# EAGLE design core-feather-shield-adc-hGacc (EAGLE 9.5.0)
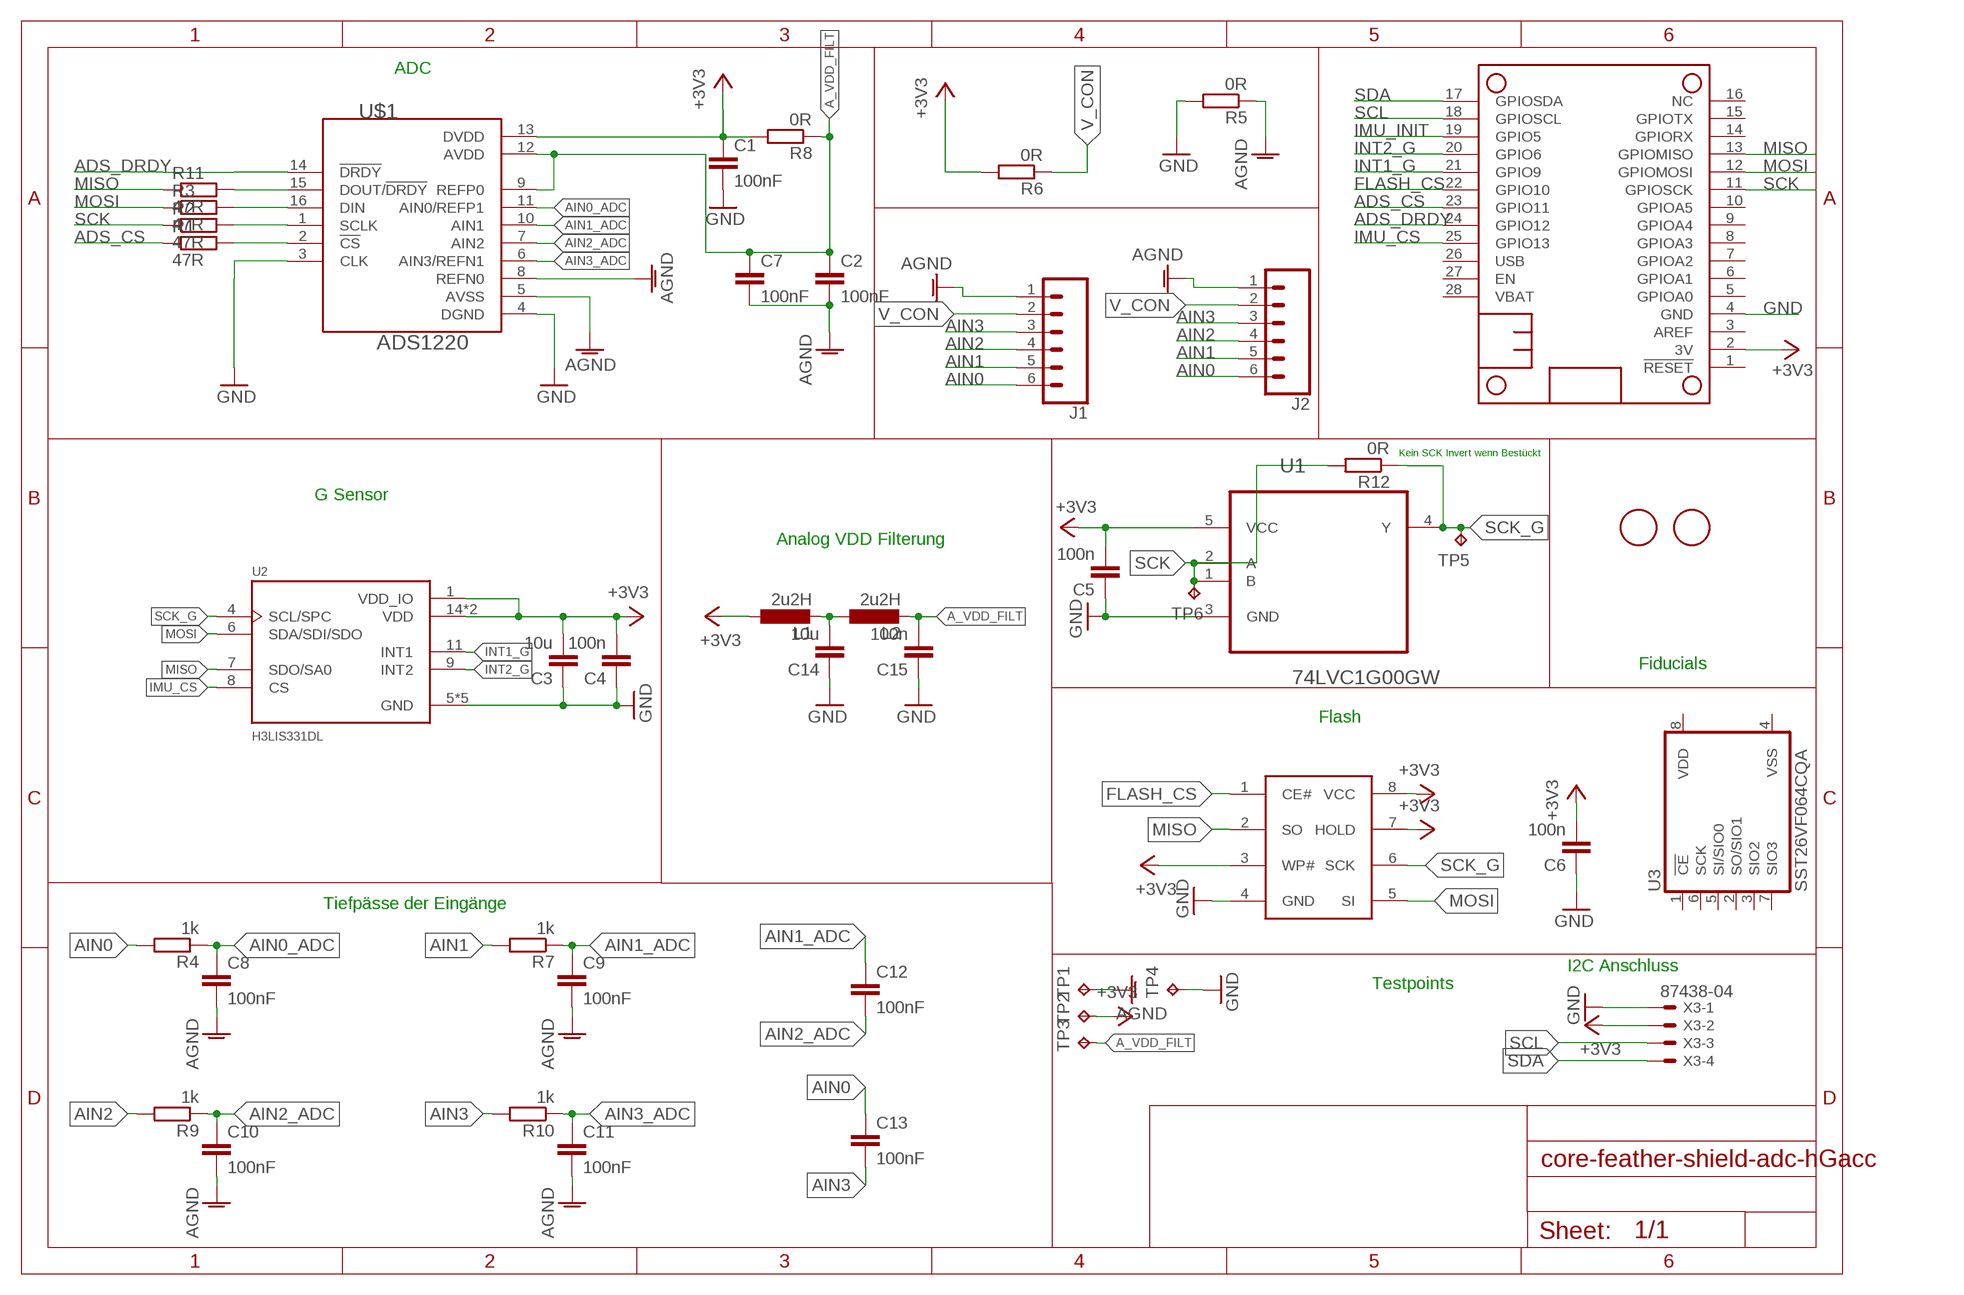
[diagram p0: schematic, sheet 1]

## Parts
C1  100nF  C-EUC0805  [C0805]
C2  100nF  C-EUC0805  [C0805]
C3  10u  C-EUC0805  [C0805]
C4  100n  C-EUC0805  [C0805]
C5  100n  C-EUC0805  [C0805]
C6  100n  C-EUC0805  [C0805]
C7  100nF  C-EUC0805  [C0805]
C8  100nF  C-EUC0805  [C0805]
C9  100nF  C-EUC0805  [C0805]
C10  100nF  C-EUC0805  [C0805]
C11  100nF  C-EUC0805  [C0805]
C12  100nF  C-EUC0805  [C0805]
C13  100nF  C-EUC0805  [C0805]
C14  10u  C-EUC0805  [C0805]
C15  100n  C-EUC0805  [C0805]
J1  CONN_06SMD_MALE  [1X06_SMD_MALE]
J2  CONN_06SMD_MALE  [1X06_SMD_MALE]
L1  2u2H  L-EUL0805  [L0805]
L2  2u2H  L-EUL0805  [L0805]
MS1  FEATHERWING  [FEATHERWING]
R1  47R  R-EU_R0805  [R0805]
R2  47R  R-EU_R0805  [R0805]
R3  47R  R-EU_R0805  [R0805]
R4  1k  R-EU_R0805  [R0805]
R5  0R  R-EU_R0805  [R0805]
R6  0R  R-EU_R0805  [R0805]
R7  1k  R-EU_R0805  [R0805]
R8  0R  R-EU_R0805  [R0805]
R9  1k  R-EU_R0805  [R0805]
R10  1k  R-EU_R0805  [R0805]
R11  47R  R-EU_R0805  [R0805]
R12  0R  R-EU_R0805  [R0805]
TP1  TPTP10R  [TP10R]
TP2  TPTP10R  [TP10R]
TP3  TPTP10R  [TP10R]
TP4  TPTP10R  [TP10R]
TP5  TPTP10R  [TP10R]
TP6  TPTP10R  [TP10R]
U1  74LVC1G00GW  [SOT65P210X110-5N]
U2  H3LIS331DL  [QFN300X300X100-16N]
U3  SST26VF064CQA  [WSON8]
U$1  ADS1220  [TSSOP-16]
U$2  IS25LP128F-JKLE-TR  [WSON-8-PAD]
U$8  FIDUCIAL  [FIDUCIAL_1MM]
U$9  FIDUCIAL  [FIDUCIAL_1MM]
X3  87438-04  [87438-04]

## Nets
+3V3: C1.1 C3.2 C4.2 C5.2 C6.2 L1.1 MS1.2(3V) R6.2 R8.2 TP2.TP U1.5(VCC) U2.1(VDD_IO) U2.14(VDD) U2.15(VDD) U$1.13(DVDD) U$2.3(WP#) U$2.7(HOLD) U$2.8(VCC) X3.2
A_VDD_FILT: C2.1 C7.1 C15.2 L2.2 R8.1 TP3.TP U$1.9(REFP0) U$1.12(AVDD)
ADS_CS: MS1.23(GPIO11) R1.1
ADS_DRDY: MS1.24(GPIO12) U$1.14(!DRDY)
AGND: C2.2 C7.2 C8.2 C9.2 C10.2 C11.2 J1.1 J2.1 R5.1 TP1.TP U$1.5(AVSS) U$1.8(REFN0)
AIN0: C13.1 J1.6 J2.6 R4.2
AIN0_ADC: C8.1 R4.1 U$1.11(AIN0/REFP1)
AIN1: J1.5 J2.5 R7.2
AIN1_ADC: C9.1 C12.1 R7.1 U$1.10(AIN1)
AIN2: J1.4 J2.4 R9.2
AIN2_ADC: C10.1 C12.2 R9.1 U$1.7(AIN2)
AIN3: C13.2 J1.3 J2.3 R10.2
AIN3_ADC: C11.1 R10.1 U$1.6(AIN3/REFN1)
FLASH_CS: MS1.22(GPIO10) U$2.1(CE#)
GND: C1.2 C3.1 C4.1 C5.1 C6.1 C14.1 C15.1 MS1.4(GND) R5.2 TP4.TP U1.3(GND) U2.5(GND) U2.10(GND) U2.12(GND) U2.13(GND) U2.16(GND) U$1.4(DGND) U$2.4(GND) X3.1
IMU_CS: MS1.25(GPIO13) U2.8(CS)
IMU_INIT: MS1.19(GPIO5)
INT1_G: MS1.21(GPIO9) U2.11(INT1)
INT2_G: MS1.20(GPIO6) U2.9(INT2)
MISO: MS1.13(GPIOMISO) R11.1 U2.7(SDO/SA0) U$2.2(SO)
MOSI: MS1.12(GPIOMOSI) R3.1 U2.6(SDA/SDI/SDO) U$2.5(SI)
N$1: R11.2 U$1.15(DOUT/!DRDY)
N$2: C14.2 L1.2 L2.1
N$3: R3.2 U$1.16(DIN)
N$4: R2.2 U$1.1(SCLK)
N$5: R1.2 U$1.2(!CS)
N$7: U$1.3(CLK)
SCK: MS1.11(GPIOSCK) R2.1 R12.2 TP6.TP U1.1(B) U1.2(A)
SCK_G: R12.1 TP5.TP U1.4(Y) U2.4(SCL/SPC) U$2.6(SCK)
SCL: MS1.18(GPIOSCL) X3.3
SDA: MS1.17(GPIOSDA) X3.4
V_CON: J1.2 J2.2 R6.1
Unconnected: MS1.1(!RESET) MS1.3(AREF) MS1.5(GPIOA0) MS1.6(GPIOA1) MS1.7(GPIOA2) MS1.8(GPIOA3) MS1.9(GPIOA4) MS1.10(GPIOA5) MS1.14(GPIORX) MS1.15(GPIOTX) MS1.16(NC) MS1.26(USB) MS1.27(EN) MS1.28(VBAT) U3.1(!CE!) U3.2(SO/SIO1) U3.3(SIO2) U3.5(SI/SIO0) U3.6(SCK) U3.7(SIO3)

## Notes on the sheet
- ADC
- Kein SCK Invert wenn Bestückt
- G Sensor
- Analog VDD Filterung
- Fiducials
- Flash
- Tiefpässe der Eingänge
- I2C Anschluss
- Testpoints

## Power pins joined to a net without a drawn wire
VDD: U3.8(VDD)
VSS: U3.4(VSS)

## Library data of the parts
C1 C2 C7-C13 = rcl:C-EU: CAPACITOR, European symbol
C3-C6 C14 C15 = rcl:C-EU: CAPACITOR, European symbol; SPICEPREFIX: C
J1 J2 = SparkFun-Connectors:CONN_06: Multi connection point. Often used as Generic Header-pin footprint for 0.1 inch spaced/style header connections On any of the 0.1 inch spaced packages, you can populate with these: Break Away Headers - Straight <https://www.sparkfun.com/products/116> (PRT-00116) Break Away Male Headers - Right Angle <https://www.sparkfun.com/products/553> (PRT-00553) Female Headers <https://www.sparkfun.com/products/115> (PRT-00115) Break Away Headers - Machine Pin <https://www.sparkfun.com/products/117> (PRT-00117) Break Away Female Headers - Swiss Machine Pin <https://www.sparkfun.com/products/743> (PRT-00743) Arduino Stackable Header - 6 Pin <https://www.sparkfun.com/products/9280> (PRT-09280) For SCREWTERMINALS and SPRING TERMINALS visit here: Screw Terimnals on SparkFun.com <https://www.sparkfun.com/search/results?term=Screw+Terminals> (5mm/3.5mm/2.54mm spacing) This device is also useful as a general connection point to wire up your design to another part of your project. Our various solder wires solder well into these plated through hole pads. Hook-Up Wire - Assortment (Stranded, 22 AWG) <https://www.sparkfun.com/products/11375> (PRT-11375) Hook-Up Wire - Assortment (Solid Core, 22 AWG) <https://www.sparkfun.com/products/11367> (PRT-11367) View the entire wire category on our website here <https://www.sparkfun.com/categories/141>; PROD_ID: CONN-11293
L1 L2 = rcl:L-EU: INDUCTOR, European symbol
MS1 = adafruit:FEATHERWING
R1-R12 = rcl:R-EU_: RESISTOR, European symbol; SPICEPREFIX: R
TP1-TP6 = testpad:TP: Test pad
U1 = 74LVC1G00GW:74LVC1G00GW: Single 2-input NAND gate; AVAILABILITY: Unavailable; DESCRIPTION: NAND Gate 1-Element 2-IN CMOS 5-Pin TSSOP T/R; MF: Nexperia; MP: 74LVC1G00GW; PACKAGE: None; PRICE: None
U2 = H3LIS331DL:H3LIS331DL: H3LIS331DL Series 3.6 V ±100/±200/±400 g 3-Axis Digital Accelerometer - TFLGA-16; AVAILABILITY: Unavailable; DESCRIPTION: H3LIS331DL Series 3.6 V ±100/±200/±400 g 3-Axis Digital Accelerometer - TFLGA-16; MF: STMicroelectronics; MP: H3LIS331DL; PACKAGE: TFLGA-16 STMicroelectronics; PRICE: None
U3 = memory-sst:SST26VF064C: EEPROM Serial Quad I/O (SQI) Flash Memory
U$1 = circuitects:ADS1220
U$2 = IS25LP128F:IS25LP128F-JKLE-TR
U$8 U$9 = audio amplifier example:FIDUCIAL: For use by pick and place machines to calibrate the vision/machine, 1mm By microbuilder.eu
X3 = con-molex:87438-04: Wire-to-Board 1.50mm (.059") Pitch Header - Right Angle, SMT, Shrouded Source: http://www.molex.com/product/micro/87438.html; MF: MOLEX; OC_FARNELL: unknown; OC_NEWARK: unknown

## Net classes
0 default: width 0.127 mm

## Board
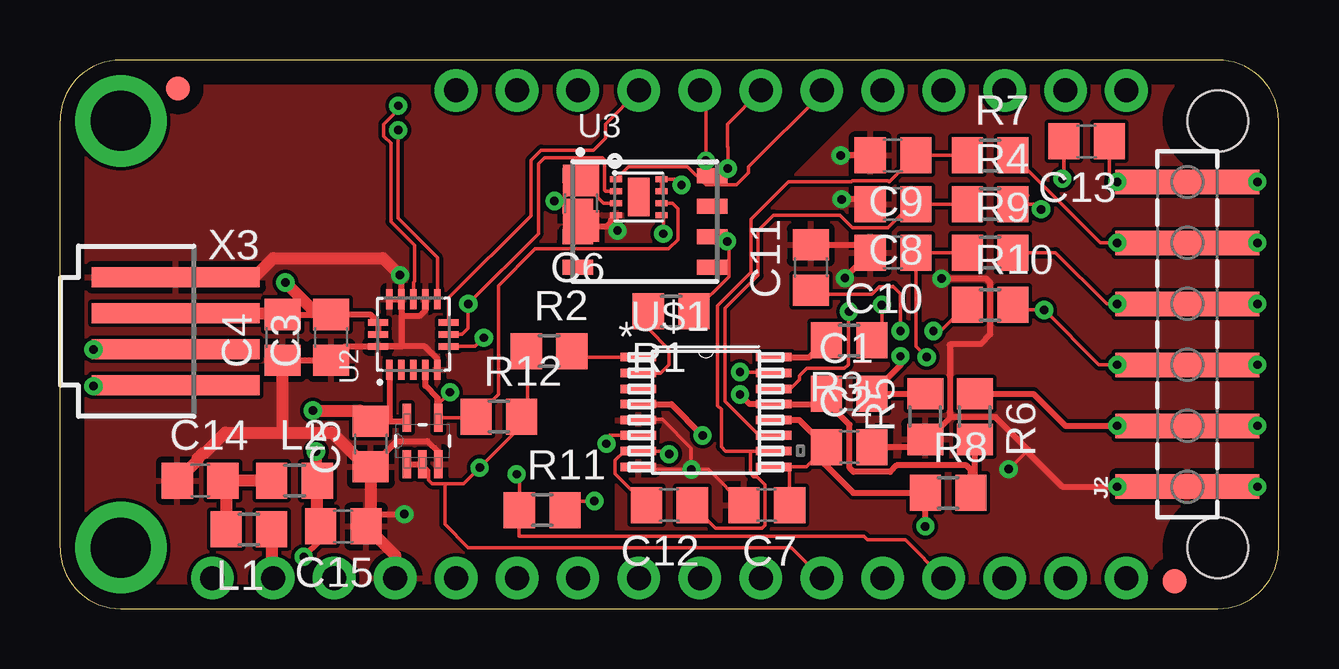
[diagram p1: board, top side]
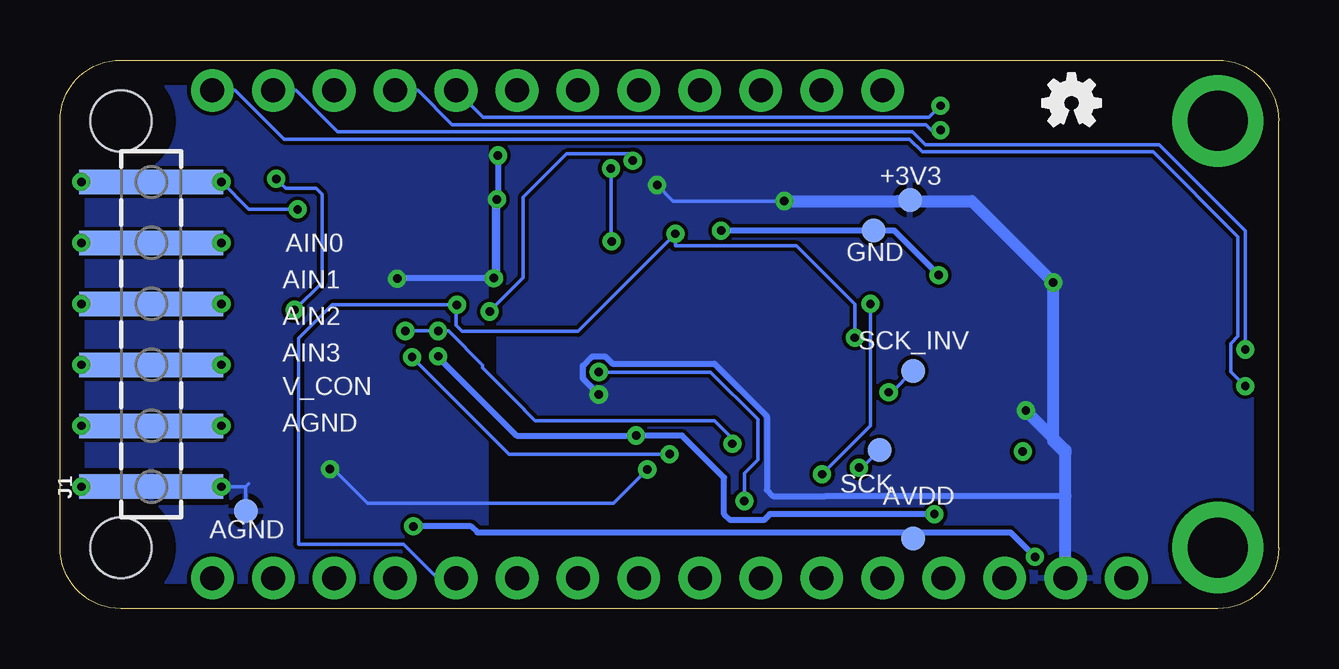
[diagram p2: board, bottom side, seen from below]

Size 50.8 x 22.86 mm. Coordinates in mm from the lower left corner, seen from the top.
Outline: 0,2.54 0,20.32
Copper layers (1*16): Top 0.035mm / dielectric 1.5mm / Bottom 0.035mm
Design rules "default": minimum track width 6mil, minimum drill 0.35mm, track to track 6mil, track to pad 6mil, pad to pad 6mil, via to via 6mil, smd to smd 6mil, copper to edge 40mil, drill to drill 6mil, minimum pad ring 10mil, minimum via ring 8mil, stop-mask expansion 4mil, vias tented up to drill 0mil, thermal gap 10mil

### Footprints (pad centres in the part's own frame; a part is rotated, then mirrored left to right if it is on the bottom)
C0805 = smd 1.3 x 1.5: 1 -0.95,0; 2 0.95,0
1X06_SMD_MALE = smd 1.02 x 6: 1 0,0; 2 2.54,0; 3 5.08,0; 4 7.62,0; 5 10.16,0; 6 12.7,0
L0805 = smd 1.3 x 1.5: 1 -0.95,0; 2 0.95,0
FEATHERWING = drill 1 pad 1.778: 1 6.35,1.27; 2 8.89,1.27; 3 11.43,1.27; 4 13.97,1.27; 5 16.51,1.27; 6 19.05,1.27; 7 21.59,1.27; 8 24.13,1.27; 9 26.67,1.27; 10 29.21,1.27; 11 31.75,1.27; 12 34.29,1.27; 13 36.83,1.27; 14 39.37,1.27; 15 41.91,1.27; 16 44.45,1.27; 17 44.45,21.59; 18 41.91,21.59; 19 39.37,21.59; 20 36.83,21.59; 21 34.29,21.59; 22 31.75,21.59; 23 29.21,21.59; 24 26.67,21.59; 25 24.13,21.59; 26 21.59,21.59; 27 19.05,21.59; 28 16.51,21.59 | drill 2.5 pad 3.81: P$1 2.54,20.32; P$2 2.54,2.54 | hole 2.54: 48.26,20.32; 48.26,2.54
R0805 = smd 1.3 x 1.5: 1 -0.95,0; 2 0.95,0
TP10R = smd 1 x 1: TP 0,0
SOT65P210X110-5N = smd 1.168 x 0.356: 1 -0.965,0.66; 2 -0.965,0; 3 -0.965,-0.66; 4 0.965,-0.66; 5 0.965,0.66
QFN300X300X100-16N = smd 0.83 x 0.27: 1 -1.47,1; 2 -1.47,0.5; 3 -1.47,0; 4 -1.47,-0.5; 5 -1.47,-1; 9 1.47,-1; 10 1.47,-0.5; 11 1.47,0; 12 1.47,0.5; 13 1.47,1 | smd 0.27 x 0.83: 6 -0.5,-1.47; 7 0,-1.47; 8 0.5,-1.47; 14 0.5,1.47; 15 0,1.47; 16 -0.5,1.47
WSON8 = smd 0.635 x 1.27: 1 -1.905,-2.81; 2 -0.635,-2.81; 3 0.635,-2.81; 4 1.905,-2.81; 5 1.905,2.81; 6 0.635,2.81; 7 -0.635,2.81; 8 -1.905,2.81
TSSOP-16 = smd 1.473 x 0.356: 1 -2.819,2.656; 2 -2.819,1.996; 3 -2.819,1.335; 4 -2.819,0.7; 5 -2.819,0.04; 6 -2.819,-0.595; 7 -2.819,-1.256; 8 -2.819,-1.916; 9 2.819,-1.916; 10 2.819,-1.256; 11 2.819,-0.595; 12 2.819,0.04; 13 2.819,0.7; 14 2.819,1.335; 15 2.819,1.996; 16 2.819,2.656
WSON-8-PAD = smd 0.25 x 0.5: 1 -0.75,-0.95; 2 -0.25,-0.95; 3 0.25,-0.95; 4 0.75,-0.95; 5 0.75,0.95; 6 0.25,0.95; 7 -0.25,0.95; 8 -0.75,0.95 | smd 1.6 x 0.9: PAD 0,0
FIDUCIAL_1MM = smd 1 x 1: 1 0,0
87438-04 = smd 7 x 0.85: 1 0,2.25; 2 0,0.75; 3 0,-0.75; 4 0,-2.25

### Placement (x,y rotation side)
C1  32.89,8.95 0 top
C2  32.89,6.73 0 top
C3  11.3,11.3 90 top
C4  9.27,11.3 90 top
C5  12.95,6.86 90 top
C6  21.72,16.89 90 top
C7  29.46,4.32 180 top
C8  34.72,16.86 180 top
C9  34.72,18.88 180 top
C10  34.72,14.84 180 top
C11  31.3,14.21 90 top
C12  25.4,4.32 180 top
C13  42.8,19.47 180 top
C14  5.84,5.33 0 top
C15  11.81,3.43 180 top
FRAME2  FRAME-LETTER  [CREATIVE_COMMONS]  -1.27,-15.11 0 top  (outside the outline)
J1  46.99,5.08 90 bottom
J2  46.99,5.08 90 top
L1  7.87,3.3 180 top
L2  9.78,5.33 0 top
LOGO1  OSHW-LOGOMINI  [OSHW-LOGO-MINI]  8.64,21.08 0 bottom
LOGO2  REVISION  [REVISION]  10.16,-17.65 0 top  (outside the outline)
MS1  0,0 0 top
R1  25.47,12.38 180 top
R2  20.38,10.73 0 top
R3  32.89,11.18 180 top
R4  38.77,16.86 0 top
R5  36.07,8 90 top
R6  38.13,8 270 top
R7  38.77,18.88 0 top
R8  37.02,4.83 0 top
R9  38.77,14.84 0 top
R10  38.77,12.66 0 top
R11  20.1,4.1 0 top
R12  18.29,8 0 top
TP1  43.05,4.06 0 bottom
TP2  15.37,17.02 0 bottom
TP3  15.24,2.92 0 bottom
TP4  16.89,15.75 0 bottom
TP5  15.24,9.91 0 bottom
TP6  16.64,6.6 0 bottom
U1  15.11,6.99 90 top
U2  14.73,11.43 90 top
U3  24.38,16.13 270 top
U$1  26.93,7.82 0 top
U$2  24.13,17.14 270 top
U$8  4.93,21.66 0 top
U$9  46.47,1.14 0 top
X3  4.83,11.56 0 top

### Tracks (layer width: path | path; a pad name or v marks a point on that pad's centre or on a via)
+3V3  (via drill 0.35)
  Top 0.152: U$2.3 22.66,16.89 C6.2 20.86,16.98 v20.61,16.98 | v25.91,17.65 25.67,17.89 U$2.8 U$2.7
  Top 0.254: 31.51,8.52 C1.1 31.94,8.63 32.02,8.56 | R8.2 37.97,5.78 | R6.2 38.13,5.62 37.97,5.78 | 32.02,8.56 32.91,7.66 32.91,5.87 33.08,5.7 34.61,5.7 34.87,5.97 37.79,5.97 37.97,5.78 | 32.02,8.56 31.98,8.52 U$1.13 28.75,8.52 v28.34,8.93 | U2.15 U2.14 12.94,12.25 C3.2 C4.2 | C5.2 13.72,7.81 | 13.72,7.81 14.31,7.81 U1.5 | U2.1 13.73,7.82 13.72,7.81
  Top 0.508: L1.1 8.82,1.34 MS1.2 | v10.54,8.26 12.51,8.26 C5.2 | v9.4,13.59 10.73,12.25 C3.2 | X3.2 9.22,12.31 C4.2
  Bottom 0.152: v20.61,16.98 25.24,16.98 v25.91,17.65 | TP2.TP 15.4,16.98 15.88,16.98
  Bottom 0.254: v28.34,8.93 29,9.59 29,10.13 28.62,10.52 28.07,10.52 27.77,10.21 23.53,10.21 21.34,8.02 21.34,4.95 21.07,4.69 18.89,4.69 18.88,4.7 8.89,4.7
  Bottom 0.508: MS1.2 8.89,4.7 8.89,6.48 | 8.89,6.48 8.89,6.6 v10.54,8.26 | v20.61,16.98 15.88,16.98 12.79,16.98 v9.4,13.59 9.4,6.99 8.89,6.48
  pour Bottom: -1.69,25.2 32.54,25.2 32.54,-2.8 -1.53,-2.8 -1.69,-2.96
A_VDD_FILT  (via drill 0.35)
  Top 0.152: U$1.9 30.35,5.9 | 30.35,5.9 31.11,5.9 C2.1 | C7.1 30.41,5.84 30.35,5.9
  Top 0.254: U$1.12 30.82,7.86 C2.1 31.88,6.67 31.88,6.01 33.07,4.83 R8.1 | R8.1 | v36.07,3.43 R8.1 | v10.16,2.16 10.86,2.86 C15.2
  Top 0.508: C15.2 10.73,3.56 L2.2 10.67,5.39 v10.67,6.55
  Bottom 0.152: TP3.TP 15.24,3.17
  Bottom 0.254: v36.07,3.43 33.66,3.43 33.4,3.17 15.24,3.17 11.18,3.17 v10.16,2.16
ADS_CS  (via drill 0.35)
  Top 0.152: v27.81,15.3 27.88,15.23 27.88,13.84 R1.1 | MS1.23 27.81,20.19 27.81,19.25 27.84,19.23 v27.84,18.34
  Bottom 0.152: v27.84,18.34 27.84,15.33 v27.81,15.3
ADS_DRDY  (via drill 0.35)
  Top 0.152: U$1.14 30.44,9.15 30.83,9.55 30.83,9.7 31.14,10.01 32.7,10.01 32.86,10.17 32.86,12.35 v32.89,12.38 | v26.92,18.67 26.92,21.34 MS1.24
  Bottom 0.152: v32.89,12.38 31.49,13.78 31.49,17.14 29.68,18.95 26.92,18.95 v26.92,18.67
AGND  (via drill 0.35)
  Top 0.152: v26.32,5.8 26.3,5.8 26.3,6.69 25.11,7.88 24.13,7.88 U$1.5 | v39.55,5.81 40.3,6.57 40.35,6.62 | 37.13,11.03 37.09,10.98 | 33.44,15.16 C10.2 | U$1.8 24.21,5.8 v26.32,5.8 | v26.32,5.8 27.03,5.8 C7.2 | J2.1 v44.07,5.08
  Top 0.254: R5.1 | R5.1 35.75,6.73 C2.2 | R5.1 36.18,7.05 37.09,7.96 | 40.35,6.62 38.99,7.98 37.11,7.98 37.09,7.96 | C9.2 v32.54,18.88 | C8.2 33.58,17.05 v32.58,17.05 | C10.2 32.72,13.78 v32.72,13.77 | C11.2 33.44,15.16 | v36.74,13.75 38.61,13.75 38.77,13.59 38.77,11.41 38.38,11.03 37.13,11.03 | 37.09,10.98 37.09,9.73 37.1,9.72 37.1,8.19 37.09,8.18 37.09,7.96 | 40.3,6.57 41.78,5.08 v44.07,5.08 | v49.91,5.08 J2.1
  Bottom 0.152: v39.55,5.81 39.39,5.81 37.97,4.4 27.72,4.4 v26.32,5.8 | v32.72,13.77 32.72,17.19 32.54,17.02 | J2.1 v44.07,5.08 43.05,5.08 | TP1.TP 43.05,5.08 | 43.05,5.08 42.93,5.21 43.05,5.08
  Bottom 0.254: v32.54,18.88 32.54,17.02 | v32.58,17.05 32.58,13.9 v32.72,13.77 36.72,13.77 v36.74,13.75
  pour Top: 23.21,-0.32 50.97,-0.32 50.97,23.09 35.66,23.09 23.21,10.63
  pour Bottom: 33.01,25.2 33.01,-3.42 56.34,-3.42 56.34,24.74 33.47,24.74
AIN0  (via drill 0.35)
  Top 0.152: 39.85,16.73 R4.2 40.67,16.86 v40.89,16.64 | 39.85,16.73 40.18,16.39 | 40.34,17.22 39.85,16.73 | J2.6 v44.07,17.78 43.75,18.1 C13.1
  Top 0.254: v49.91,17.78 J2.6
  Bottom 0.152: v44.07,17.78 44.2,17.78 | J2.6 v44.07,17.78 | v40.89,16.64 42.93,16.64 v44.07,17.78
AIN0_ADC
  Top 0.152: R4.1 35.81,16.86 C8.1 35.5,16.86 34.52,15.88 33.03,15.88 32.52,16.39 29.74,16.39 29.1,15.75 29.1,13.88 27.72,12.51 27.72,8.65 29.23,7.14 29.66,7.14 U$1.11 29.73,7.21
AIN1  (via drill 0.35)
  Top 0.152: 40.1,18.88 R7.2 43.36,15.24 v44.07,15.24 J2.5
  Top 0.254: 49.66,15.24 J2.5 v49.91,15.24
  Bottom 0.152: v44.07,15.24 43.94,15.24 J2.5
  Bottom 0.254: J2.5 49.28,15.24 J2.5
AIN1_ADC
  Top 0.152: R7.1 C9.1 34.58,17.79 34.56,17.79 34.52,17.84 33.03,17.84 32.98,17.79 30.37,17.79 28.79,16.22 28.79,14.01 27.41,12.63 27.41,8.46 27.57,8.3 27.57,6.75 27.75,6.56 28.7,6.56 | 28.7,6.56 U$1.10 | 26.93,4.32 C12.1 27.33,3.34 29.26,3.34 29.39,3.47 29.39,5.16 29.06,5.5 28.91,5.5 28.78,5.63 28.78,6.49 28.7,6.56
AIN2  (via drill 0.35)
  Top 0.152: R9.2 41.5,14.84 43.63,12.7 v44.07,12.7 J2.4
  Top 0.254: v49.91,12.7 J2.4
  Bottom 0.152: J2.4 v44.07,12.7
AIN2_ADC  (via drill 0.35)
  Top 0.152: v36.12,10.48 35.67,10.93 C10.1 R9.1 | v25.39,6.44 v25.38,6.44 25.31,6.51 25.26,6.56 U$1.7 23.53,6.56 23.14,6.18 23.14,5.63 C12.2
  Bottom 0.152: v25.39,6.44 32.08,6.44 v36.12,10.48
AIN3  (via drill 0.35)
  Top 0.152: R10.2 39.93,12.45 v41.02,12.45 43.31,10.16 v44.07,10.16 J2.3 | C13.2 41.85,17.97 v41.78,17.91
  Top 0.254: v49.91,10.16 J2.3
  Bottom 0.152: v41.02,12.45 39.88,13.59 39.88,17.27 40.13,17.53 41.4,17.53 v41.78,17.91 | v44.07,10.16 J2.3
AIN3_ADC  (via drill 0.35)
  Top 0.152: R10.1 36.73,11.57 v36.41,11.57 | v22.77,6.87 22.66,6.98 22.91,7.22 U$1.6 | v35.03,11.57 35.03,13.12 34.72,13.44 34.71,13.42 34.16,13.42 33.85,13.11 31.45,13.11 C11.1
  Bottom 0.152: v36.41,11.57 v35.03,11.57 34.6,11.57 33.18,10.15 33.18,10.03 31.44,8.29 31.44,8.27 31.01,7.84 23.52,7.84 22.87,7.18 22.77,7.18 v22.77,6.87
FLASH_CS
  Top 0.152: U$2.1 23.7,18.41 26.16,18.41 26.92,17.65 28.19,17.65 28.7,18.16 28.7,18.41 31.75,21.46 MS1.22
GND  (via drill 0.35)
  Top 0.152: 23.83,8.52 U$1.4 | C1.2 33.41,9.39 | U2.5 15.79,9.91 | 15.21,10.93 14.22,10.93 | C6.1 22.73,15.94 22.95,16.17 U$2.4
  Top 0.254: R5.2 C1.2 35.03,10.14 v35.03,10.52 | U$1.4 25.48,8.52 v26.79,7.21 | C4.1 C3.1 11.88,10.93 U2.16 | U2.13 U2.12 | C5.1 14.03,6.99 15.3,6.99 15.77,6.52 U1.3 | U2.16 14.22,10.93 14.23,10.94 14.23,12.19 | U2.5 15.72,10.41 15.21,10.93 U2.16 | U2.12 14.23,12.19 | U2.10 15.23,12.44 14.99,12.19 14.23,12.19 | U2.12 14.23,13.84 v14.17,13.89 | v23.24,15.75 23.18,15.81 U$2.4 | C6.1 23.05,15.94 v23.24,15.75 | v23.24,15.75 23.24,15.88 22.95,16.17 | C15.1 13.27,3.94 v14.35,3.94
  Top 0.508: C15.1 12.92,3.27 | 12.92,3.27 13.97,2.22 MS1.4 | C5.1 12.95,5.71 | 12.95,5.71 12.95,3.3 12.92,3.27 | C4.1 9.27,7.43 9.18,7.33 | C14.1 5.74,6.18 5.74,6.25 5.97,6.49 6.05,6.49 6.89,7.33 9.18,7.33 | 9.18,7.33 11.34,7.33 12.95,5.71 | X3.1 8.09,13.81 8.89,14.61 13.46,14.61 v14.17,13.89
  Bottom 0.152: TP4.TP 17.53,15.75
  Bottom 0.254: v35.03,10.52 35.03,10.48 31.77,7.21 v26.79,7.21 24.87,7.21 23.11,5.46 23.11,3.94 22.86,3.68 21.46,3.68 21.21,3.94 v14.35,3.94 | v14.17,13.89 16.03,15.75 17.53,15.75 v23.24,15.75
  pour Top: 35.38,23.4 51.38,23.4 51.38,-1.02 23.98,-1.02 23.98,-2.49 23.83,-2.64 55.57,-2.64 55.57,24.11 -4.18,24.11 -4.33,23.96 -4.33,-3.11 -4.49,-3.27 22.84,-3.27 22.84,10.86
IMU_CS
  Top 0.152: U2.8 16.2,12.95 19.63,16.38 19.63,18.68 20.06,19.1 22.23,19.1 22.73,19.6 22.73,20.19 MS1.25
INT1_G  (via drill 0.35)
  Top 0.152: U2.11 14.73,13.6 14.78,13.64 14.78,15.14 13.79,16.13 13.79,19.39 13.49,19.69 13.49,20.19 14.1,20.8 v14.1,20.95
  Bottom 0.152: 14.86,20.47 33.17,20.47 MS1.21 | 14.86,20.47 14.78,20.47 | 14.86,20.47 14.58,20.47 v14.1,20.95
INT2_G  (via drill 0.35)
  Top 0.152: v14.1,19.94 14.1,16.26 15.73,14.62 U2.9
  Bottom 0.152: MS1.20 35.87,21.59 34.45,20.17 14.71,20.17 14.48,19.94 v14.1,19.94
MISO  (via drill 0.35)
  Top 0.152: 33.38,3.02 33.15,3.02 | 33.15,3.02 19.14,3.02 19.14,4.09 R11.1 19.15,5.49 v19.04,5.6 | 16.57,11.43 U2.7 16.76,11.43 17.02,11.68 v17.02,12.7 19.94,15.62 19.94,18.54 20.19,18.8 22.61,18.8 22.7,18.71 22.7,17.44 22.74,17.39 U$2.2 | 33.15,3.02 33.5,3.02 33.65,2.87 35.23,2.87 MS1.13
  Bottom 0.152: v17.02,12.7 17.02,7.62 v19.04,5.6
MOSI  (via drill 0.35)
  Top 0.152: R3.1 34.26,11.59 v34.26,12.66 | U2.6 17.31,10.93 v17.67,11.29 | U$2.5 25.15,16.33 v25.15,15.62
  Bottom 0.152: v34.26,12.66 34.29,12.66 | 34.29,12.66 39.46,12.66 40.86,11.26 40.86,2.69 36.48,2.69 35.05,1.27 MS1.12 | 34.29,12.66 34.29,11.81 34.04,11.56 29.21,11.56 v25.15,15.62 25.15,15.11 20.1,15.11 17.67,12.69 v17.67,11.29
N$1  (via drill 0.35)
  Top 0.152: v22.28,4.48 21.43,4.48 R11.2 | v28.34,9.86 29.7,9.86 U$1.15
  Bottom 0.152: v22.28,4.48 22.28,5.64 21.71,6.21 21.71,7.89 23.68,9.86 v28.34,9.86
N$2
  Top 0.508: L2.1 C14.2 6.92,5.2 L1.2
N$3
  Top 0.254: U$1.16 31.24,10.47 R3.2
N$4
  Top 0.152: U$1.1 21.59,10.47 R2.2
N$5
  Top 0.152: R1.2 24.52,11.66 25.39,10.79 25.39,10.17 25.03,9.81 U$1.2
SCK  (via drill 0.35)
  Top 0.152: 19.11,10.73 19.18,10.73 | 19.18,10.73 R2.1 19.48,10.78 19.48,10.29 | 19.11,10.79 19.18,10.73 | 16.05,5.21 15.5,5.21 15.37,5.34 15.37,5.77 U1.2 | 19.48,8.64 19.48,10.29 | MS1.11 30.48,2.54 17.02,2.54 16.05,3.51 16.05,5.21 | 16.05,5.21 16.82,5.21 v17.49,5.88 19.24,7.62 R12.2 19.48,8.24 19.48,10.29
  Top 0.254: U1.1 U1.2
  Bottom 0.152: TP6.TP 17.37,5.88 v17.49,5.88
SCK_G  (via drill 0.35)
  Top 0.152: U2.4 | v16.26,9.02 15.77,8.53 U1.4 17.29,7.95 R12.1 18.27,8.94 18.27,13.45 19.81,14.99 25.37,14.99 25.75,15.37 25.75,16.66 25.52,16.89 U$2.6
  Top 0.254: U1.4 15.75,7.98 | 15.75,7.98 15.75,8.76 15.23,9.28 U2.4 | 15.75,7.98
  Bottom 0.152: v16.26,9.02 16.13,9.02 TP5.TP
SCL  (via drill 0.35)
  Top 0.152: v1.39,10.79 4.81,10.79 X3.3
  Bottom 0.152: MS1.18 40.95,21.59 39.22,19.86 15.26,19.86 14.73,19.33 4.98,19.33 1.39,15.74 v1.39,10.79
SDA  (via drill 0.35)
  Top 0.152: v1.39,9.27 4.79,9.27 X3.4
  Bottom 0.152: MS1.17 43.49,21.59 41.46,19.56 15.39,19.56 14.86,19.03 5.23,19.03 1.7,15.49 1.7,11.35 2,11.05 2,9.88 v1.39,9.27
V_CON  (via drill 0.35)
  Top 0.152: R6.1 38.64,8.44 | v44.07,7.62 J2.2
  Top 0.254: R6.1 38.45,9.27 | R6.1 38.48,8.95 | R6.1 40.58,8.95 41.91,7.62 v44.07,7.62 | J2.2 48.39,7.62 | 48.39,7.62 49.66,7.62 | v49.91,7.62 48.39,7.62
  Bottom 0.152: J2.2 v44.07,7.62

### Text on the board
bPlace: +3V3 | GND | SCK_INV | SCK | AVDD | AGND
bNames: AIN0 | AIN1 | AIN2 | AIN3 | V_CON | AGND
tDocu: M. Hessinger | S. Suppelt